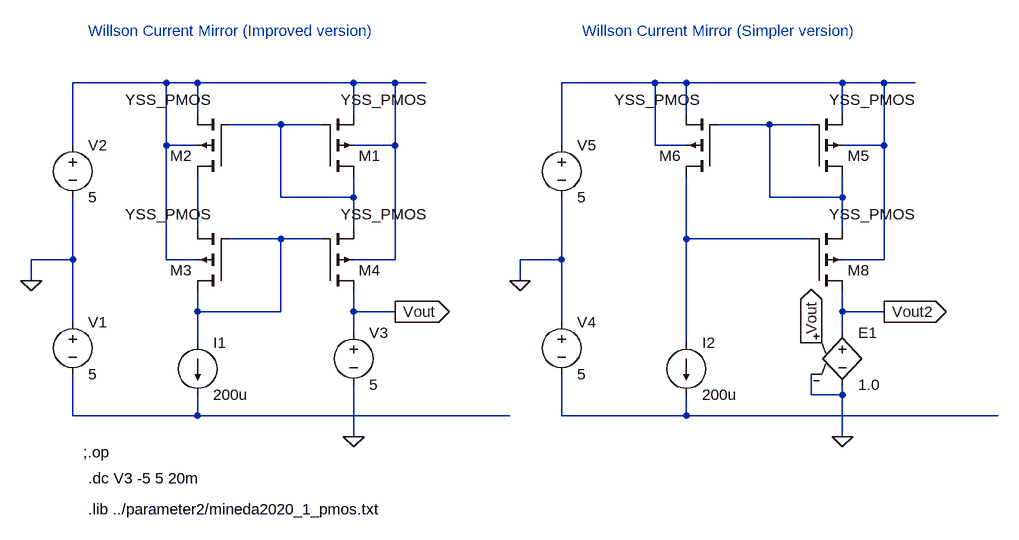
[diagram p0: schematic currentsource_test14umWilson.asc]
currentsource_test14umWilson.asc, the LTspice schematic file:
Version 4
SHEET 1 1536 2968
WIRE -368 -192 -512 -192
WIRE -320 -192 -368 -192
WIRE -80 -192 -320 -192
WIRE -16 -192 -80 -192
WIRE 32 -192 -16 -192
WIRE 384 -192 240 -192
WIRE 432 -192 384 -192
WIRE 672 -192 432 -192
WIRE 736 -192 672 -192
WIRE 784 -192 736 -192
WIRE -320 -144 -320 -192
WIRE -80 -144 -80 -192
WIRE 432 -144 432 -192
WIRE 672 -144 672 -192
WIRE -192 -128 -272 -128
WIRE -128 -128 -192 -128
WIRE 560 -128 480 -128
WIRE 624 -128 560 -128
WIRE -512 -96 -512 -192
WIRE -368 -96 -368 -192
WIRE -320 -96 -368 -96
WIRE -16 -96 -16 -192
WIRE -16 -96 -80 -96
WIRE 240 -96 240 -192
WIRE 384 -96 384 -192
WIRE 432 -96 384 -96
WIRE 736 -96 736 -192
WIRE 736 -96 672 -96
WIRE -192 -16 -192 -128
WIRE -80 -16 -80 -48
WIRE -80 -16 -192 -16
WIRE 560 -16 560 -128
WIRE 672 -16 672 -48
WIRE 672 -16 560 -16
WIRE -320 32 -320 -48
WIRE -80 32 -80 -16
WIRE 672 32 672 -16
WIRE -192 48 -272 48
WIRE -128 48 -192 48
WIRE 432 48 432 -48
WIRE 624 48 432 48
WIRE -512 80 -512 -16
WIRE -512 80 -576 80
WIRE -368 80 -368 -96
WIRE -320 80 -368 80
WIRE -16 80 -16 -96
WIRE -16 80 -80 80
WIRE 240 80 240 -16
WIRE 240 80 176 80
WIRE 736 80 736 -96
WIRE 736 80 672 80
WIRE -576 112 -576 80
WIRE 176 112 176 80
WIRE -320 160 -320 128
WIRE -192 160 -192 48
WIRE -192 160 -320 160
WIRE -80 160 -80 128
WIRE -16 160 -80 160
WIRE 672 160 672 128
WIRE 736 160 672 160
WIRE -512 176 -512 80
WIRE 240 176 240 80
WIRE -80 192 -80 160
WIRE 672 192 672 160
WIRE -320 208 -320 160
WIRE 432 208 432 48
WIRE 624 288 624 256
WIRE 672 288 672 272
WIRE 672 288 624 288
WIRE -512 320 -512 256
WIRE -320 320 -320 288
WIRE -320 320 -512 320
WIRE 160 320 -320 320
WIRE 240 320 240 256
WIRE 432 320 432 288
WIRE 432 320 240 320
WIRE 912 320 432 320
WIRE -80 352 -80 272
WIRE 672 352 672 288
FLAG -576 112 0
FLAG -16 160 Vout
IOPIN -16 160 Out
FLAG -80 352 0
FLAG 176 112 0
FLAG 736 160 Vout2
IOPIN 736 160 Out
FLAG 672 352 0
FLAG 624 208 Vout
IOPIN 624 208 Out
SYMBOL voltage -512 160 R0
WINDOW 123 0 0 Left 2
WINDOW 39 0 0 Left 2
SYMATTR InstName V1
SYMATTR Value 5
SYMBOL pmos4 -128 -48 M180
WINDOW 3 28 118 Left 2
SYMATTR Value YSS_PMOS
SYMATTR InstName M1
SYMATTR Value2 l=14u w=14u m=20
SYMBOL voltage -512 -112 R0
WINDOW 123 0 0 Left 2
WINDOW 39 0 0 Left 2
SYMATTR InstName V2
SYMATTR Value 5
SYMBOL current -320 208 R0
WINDOW 123 0 0 Left 2
WINDOW 39 0 0 Left 2
SYMATTR InstName I1
SYMATTR Value 200u
SYMBOL pmos4 -272 -48 R180
WINDOW 3 28 118 Left 2
SYMATTR Value YSS_PMOS
SYMATTR InstName M2
SYMATTR Value2 l=14u w=14u m=20
SYMBOL voltage -80 176 R0
WINDOW 123 0 0 Left 2
WINDOW 39 0 0 Left 2
SYMATTR InstName V3
SYMATTR Value 5
SYMBOL pmos4 -272 128 R180
WINDOW 3 28 118 Left 2
SYMATTR Value YSS_PMOS
SYMATTR InstName M3
SYMATTR Value2 l=14u w=14u m=40
SYMBOL pmos4 -128 128 M180
WINDOW 3 28 118 Left 2
SYMATTR Value YSS_PMOS
SYMATTR InstName M4
SYMATTR Value2 l=14u w=14u m=40
SYMBOL voltage 240 160 R0
WINDOW 123 0 0 Left 2
WINDOW 39 0 0 Left 2
SYMATTR InstName V4
SYMATTR Value 5
SYMBOL pmos4 624 -48 M180
WINDOW 3 28 118 Left 2
SYMATTR Value YSS_PMOS
SYMATTR InstName M5
SYMATTR Value2 l=14u w=14u m=30
SYMBOL voltage 240 -112 R0
WINDOW 123 0 0 Left 2
WINDOW 39 0 0 Left 2
SYMATTR InstName V5
SYMATTR Value 5
SYMBOL current 432 208 R0
WINDOW 123 0 0 Left 2
WINDOW 39 0 0 Left 2
SYMATTR InstName I2
SYMATTR Value 200u
SYMBOL pmos4 480 -48 R180
WINDOW 3 28 118 Left 2
SYMATTR Value YSS_PMOS
SYMATTR InstName M6
SYMATTR Value2 l=14u w=14u m=30
SYMBOL pmos4 624 128 M180
WINDOW 3 28 118 Left 2
SYMATTR Value YSS_PMOS
SYMATTR InstName M8
SYMATTR Value2 l=14u w=14u m=40
SYMBOL e 672 176 R0
SYMATTR InstName E1
SYMATTR Value 1.0
TEXT -488 416 Left 2 !.dc V3 -5 5 20m
TEXT -488 464 Left 2 !.lib ../parameter2/mineda2020_1_pmos.txt
TEXT -496 376 Left 2 !;.op
TEXT -488 -272 Left 2 ;Willson Current Mirror (Improved version)
TEXT 272 -272 Left 2 ;Willson Current Mirror (Simpler version)

The netlist it stands for:
* currentsource_test14umWilson.asc
V1 0 N008 5
M1 N003 N003 N001 N001 YSS_PMOS l=14u w=14u m=20
V2 N001 0 5
I1 N006 N008 200u
M2 N005 N003 N001 N001 YSS_PMOS l=14u w=14u m=20
V3 Vout 0 5
M3 N006 N006 N005 N001 YSS_PMOS l=14u w=14u m=40
M4 Vout N006 N003 N001 YSS_PMOS l=14u w=14u m=40
V4 0 N009 5
M5 N004 N004 N002 N002 YSS_PMOS l=14u w=14u m=30
V5 N002 0 5
I2 N007 N009 200u
M6 N007 N004 N002 N002 YSS_PMOS l=14u w=14u m=30
M8 Vout2 N007 N004 N002 YSS_PMOS l=14u w=14u m=40
E1 Vout2 0 Vout 0 1.0
.model NMOS NMOS
.model PMOS PMOS
.lib standard.mos
.dc V3 -5 5 20m
.lib ../parameter2/mineda2020_1_pmos.txt
;.op
* Willson Current Mirror (Improved version)
* Willson Current Mirror (Simpler version)
.backanno
.end